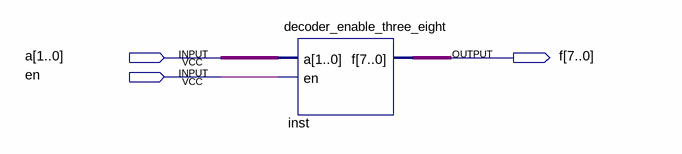
[diagram p0: schematic sheet]
// Quartus schematic Block1.bdf as structural Verilog: 1 symbols, 3 pins
module Block1 (
  input  [1:0] a,
  input  en,
  output [7:0] f
);

  decoder_enable_three_eight inst (.a(a), .en(en), .f(f));
endmodule
